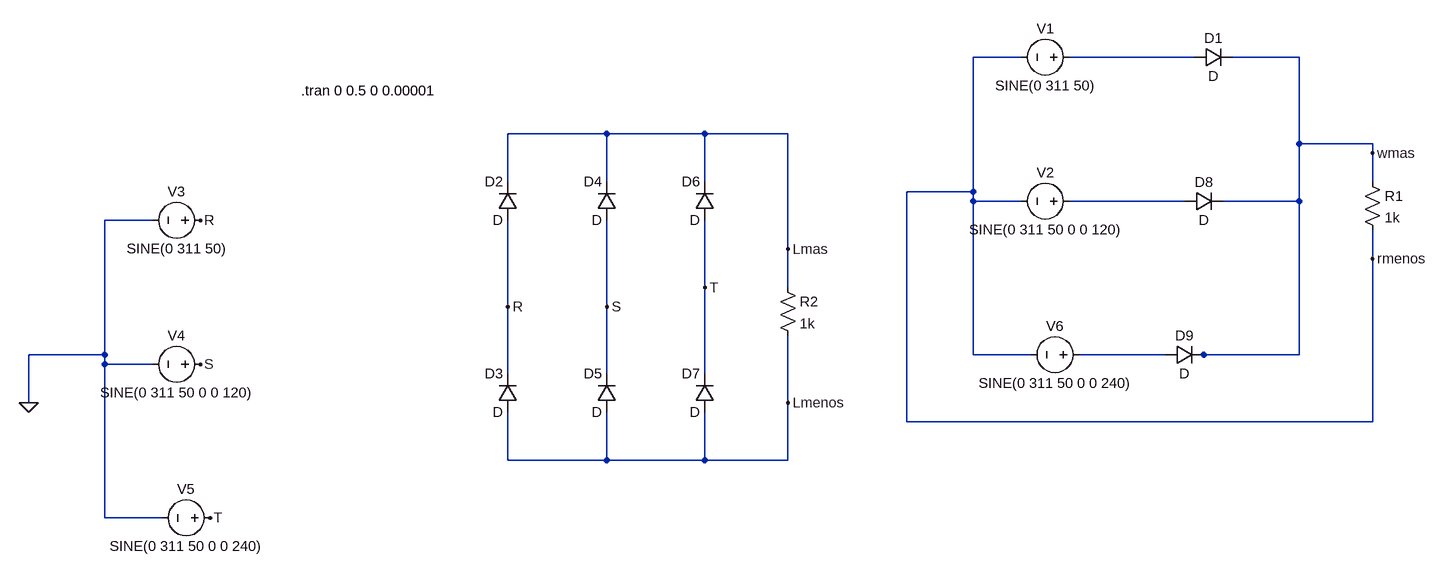
[diagram p0: schematic Draft3.asc]
Draft3.asc, the LTspice schematic file:
Version 4.1
SHEET 1 4508 680
WIRE 3600 -1232 3520 -1232
WIRE 3888 -1232 3680 -1232
WIRE 4096 -1232 3952 -1232
WIRE 2064 -1104 1824 -1104
WIRE 2304 -1104 2064 -1104
WIRE 2544 -1104 2304 -1104
WIRE 4096 -1088 4096 -1232
WIRE 4432 -1088 4096 -1088
WIRE 4432 -1072 4432 -1088
WIRE 1824 -1024 1824 -1104
WIRE 2064 -1024 2064 -1104
WIRE 2304 -1024 2304 -1104
WIRE 4432 -1024 4432 -1072
WIRE 3520 -1008 3520 -1232
WIRE 3520 -1008 3392 -1008
WIRE 3520 -992 3520 -1008
WIRE 3600 -992 3520 -992
WIRE 3872 -992 3680 -992
WIRE 4096 -992 4096 -1088
WIRE 4096 -992 3936 -992
WIRE 1232 -960 1152 -960
WIRE 2544 -912 2544 -1104
WIRE 4432 -896 4432 -944
WIRE 2304 -848 2304 -960
WIRE 2544 -848 2544 -912
WIRE 1824 -816 1824 -960
WIRE 2064 -816 2064 -960
WIRE 1152 -736 1152 -960
WIRE 1152 -736 1024 -736
WIRE 3520 -736 3520 -992
WIRE 3616 -736 3520 -736
WIRE 3840 -736 3696 -736
WIRE 3904 -736 3888 -736
WIRE 4096 -736 4096 -992
WIRE 4096 -736 3904 -736
WIRE 1152 -720 1152 -736
WIRE 1232 -720 1152 -720
WIRE 1824 -704 1824 -816
WIRE 2064 -704 2064 -816
WIRE 2304 -704 2304 -848
WIRE 1024 -656 1024 -736
WIRE 2544 -656 2544 -768
WIRE 3392 -624 3392 -1008
WIRE 4432 -624 4432 -896
WIRE 4432 -624 3392 -624
WIRE 1824 -560 1824 -640
WIRE 2064 -560 2064 -640
WIRE 2064 -560 1824 -560
WIRE 2304 -560 2304 -640
WIRE 2304 -560 2064 -560
WIRE 2544 -560 2544 -656
WIRE 2544 -560 2304 -560
WIRE 1152 -464 1152 -720
WIRE 1248 -464 1152 -464
FLAG 1312 -960 R
FLAG 1824 -816 R
FLAG 1312 -720 S
FLAG 2064 -816 S
FLAG 1328 -464 T
FLAG 2304 -848 T
FLAG 1024 -656 0
FLAG 2544 -912 Lmas
FLAG 2544 -656 Lmenos
FLAG 4432 -896 rmenos
FLAG 4432 -1072 wmas
SYMBOL voltage 1328 -960 R90
WINDOW 0 -32 56 VBottom 2
WINDOW 3 32 56 VTop 2
WINDOW 123 0 0 Left 0
WINDOW 39 0 0 Left 0
SYMATTR InstName V3
SYMATTR Value SINE(0 311 50)
SYMBOL diode 1840 -960 R180
WINDOW 0 24 64 Left 2
WINDOW 3 24 0 Left 2
SYMATTR InstName D2
SYMBOL diode 1840 -640 R180
WINDOW 0 24 64 Left 2
WINDOW 3 24 0 Left 2
SYMATTR InstName D3
SYMBOL diode 2080 -960 R180
WINDOW 0 24 64 Left 2
WINDOW 3 24 0 Left 2
SYMATTR InstName D4
SYMBOL diode 2080 -640 R180
WINDOW 0 24 64 Left 2
WINDOW 3 24 0 Left 2
SYMATTR InstName D5
SYMBOL diode 2320 -960 R180
WINDOW 0 24 64 Left 2
WINDOW 3 24 0 Left 2
SYMATTR InstName D6
SYMBOL diode 2320 -640 R180
WINDOW 0 24 64 Left 2
WINDOW 3 24 0 Left 2
SYMATTR InstName D7
SYMBOL res 2528 -864 R0
SYMATTR InstName R2
SYMATTR Value 1k
SYMBOL voltage 1328 -720 R90
WINDOW 0 -32 56 VBottom 2
WINDOW 3 32 56 VTop 2
WINDOW 123 0 0 Left 0
WINDOW 39 0 0 Left 0
SYMATTR InstName V4
SYMATTR Value SINE(0 311 50 0 0 120)
SYMBOL voltage 1344 -464 R90
WINDOW 0 -32 56 VBottom 2
WINDOW 3 32 56 VTop 2
WINDOW 123 0 0 Left 0
WINDOW 39 0 0 Left 0
SYMATTR InstName V5
SYMATTR Value SINE(0 311 50 0 0 240)
SYMBOL voltage 3696 -1232 R90
WINDOW 0 -32 56 VBottom 2
WINDOW 3 32 56 VTop 2
WINDOW 123 0 0 Left 0
WINDOW 39 0 0 Left 0
SYMATTR InstName V1
SYMATTR Value SINE(0 311 50)
SYMBOL voltage 3696 -992 R90
WINDOW 0 -32 56 VBottom 2
WINDOW 3 32 56 VTop 2
WINDOW 123 0 0 Left 0
WINDOW 39 0 0 Left 0
SYMATTR InstName V2
SYMATTR Value SINE(0 311 50 0 0 120)
SYMBOL voltage 3712 -736 R90
WINDOW 0 -32 56 VBottom 2
WINDOW 3 32 56 VTop 2
WINDOW 123 0 0 Left 0
WINDOW 39 0 0 Left 0
SYMATTR InstName V6
SYMATTR Value SINE(0 311 50 0 0 240)
SYMBOL diode 3888 -1216 R270
WINDOW 0 32 32 VTop 2
WINDOW 3 0 32 VBottom 2
SYMATTR InstName D1
SYMBOL diode 3872 -976 R270
WINDOW 0 32 32 VTop 2
WINDOW 3 0 32 VBottom 2
SYMATTR InstName D8
SYMBOL diode 3840 -720 R270
WINDOW 0 32 32 VTop 2
WINDOW 3 0 32 VBottom 2
SYMATTR InstName D9
SYMBOL res 4416 -1040 R0
SYMATTR InstName R1
SYMATTR Value 1k
TEXT 1480 -1176 Left 2 !.tran 0 0.5 0 0.00001

The netlist it stands for:
* Draft3.asc
V3 R 0 SINE(0 311 50)
D2 R Lmas D
D3 Lmenos R D
D4 S Lmas D
D5 Lmenos S D
D6 T Lmas D
D7 Lmenos T D
R2 Lmas Lmenos 1k
V4 S 0 SINE(0 311 50 0 0 120)
V5 T 0 SINE(0 311 50 0 0 240)
V1 N001 rmenos SINE(0 311 50)
V2 N002 rmenos SINE(0 311 50 0 0 120)
V6 N003 rmenos SINE(0 311 50 0 0 240)
D1 N001 wmas D
D8 N002 wmas D
D9 N003 wmas D
R1 wmas rmenos 1k
.model D D
.lib standard.dio
.tran 0 0.5 0 0.00001
.backanno
.end